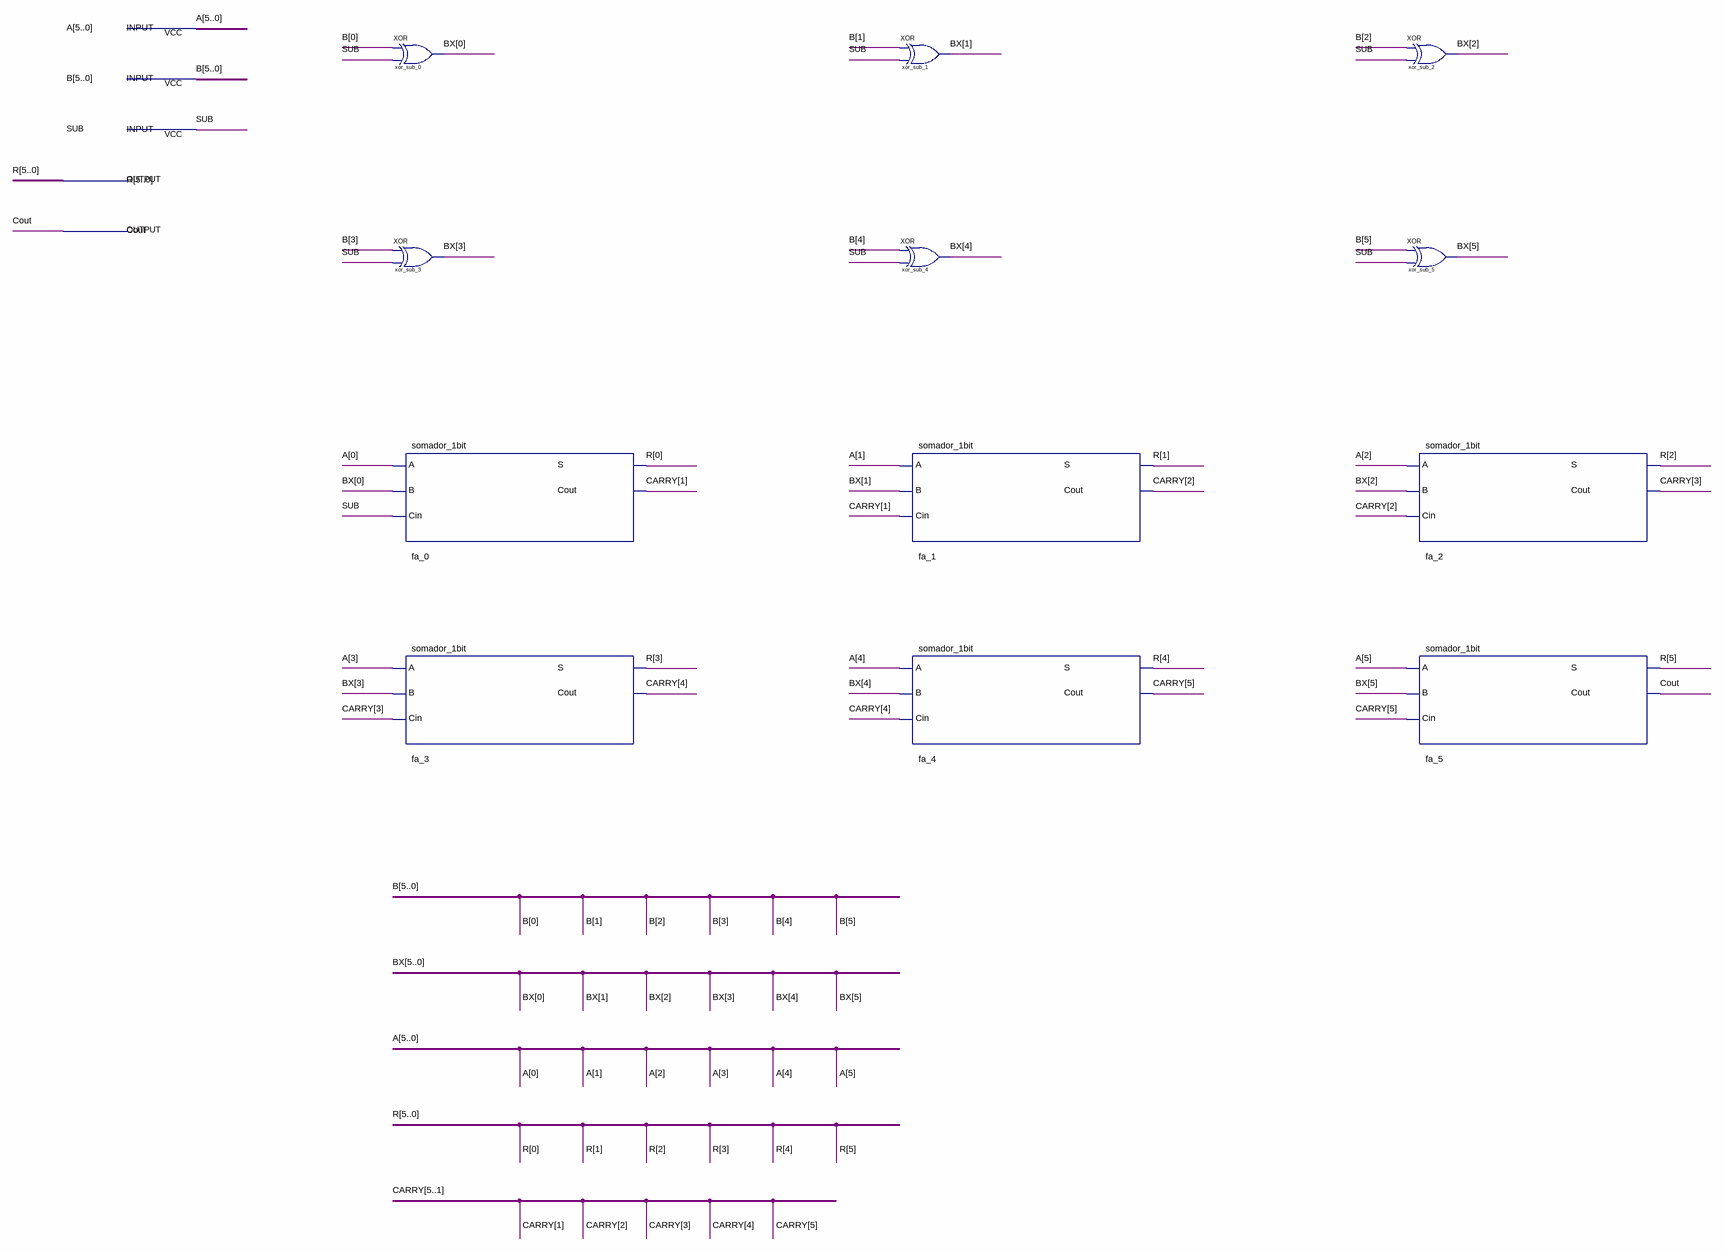
[diagram p0: schematic sheet]
// Quartus schematic somador_subtrator_6bit.bdf as structural Verilog: 12 symbols, 5 pins
module somador_subtrator_6bit (
  input  [5:0] A,
  input  [5:0] B,
  input  SUB,
  output [5:0] R,
  output Cout
);

  wire [5:0] BX;
  wire [5:1] CARRY;

  xor xor_sub_0 (BX[0], B[0], SUB);
  xor xor_sub_3 (BX[3], B[3], SUB);
  somador_1bit fa_0 (.A(A[0]), .B(BX[0]), .Cin(SUB), .S(R[0]), .Cout(CARRY[1]));
  somador_1bit fa_3 (.A(A[3]), .B(BX[3]), .Cin(CARRY[3]), .S(R[3]), .Cout(CARRY[4]));
  xor xor_sub_1 (BX[1], B[1], SUB);
  xor xor_sub_4 (BX[4], B[4], SUB);
  somador_1bit fa_1 (.A(A[1]), .B(BX[1]), .Cin(CARRY[1]), .S(R[1]), .Cout(CARRY[2]));
  somador_1bit fa_4 (.A(A[4]), .B(BX[4]), .Cin(CARRY[4]), .S(R[4]), .Cout(CARRY[5]));
  xor xor_sub_2 (BX[2], B[2], SUB);
  xor xor_sub_5 (BX[5], B[5], SUB);
  somador_1bit fa_2 (.A(A[2]), .B(BX[2]), .Cin(CARRY[2]), .S(R[2]), .Cout(CARRY[3]));
  somador_1bit fa_5 (.A(A[5]), .B(BX[5]), .Cin(CARRY[5]), .S(R[5]), .Cout(Cout));
endmodule
